# EAGLE schematic LineOut (EAGLE 7.7.0)
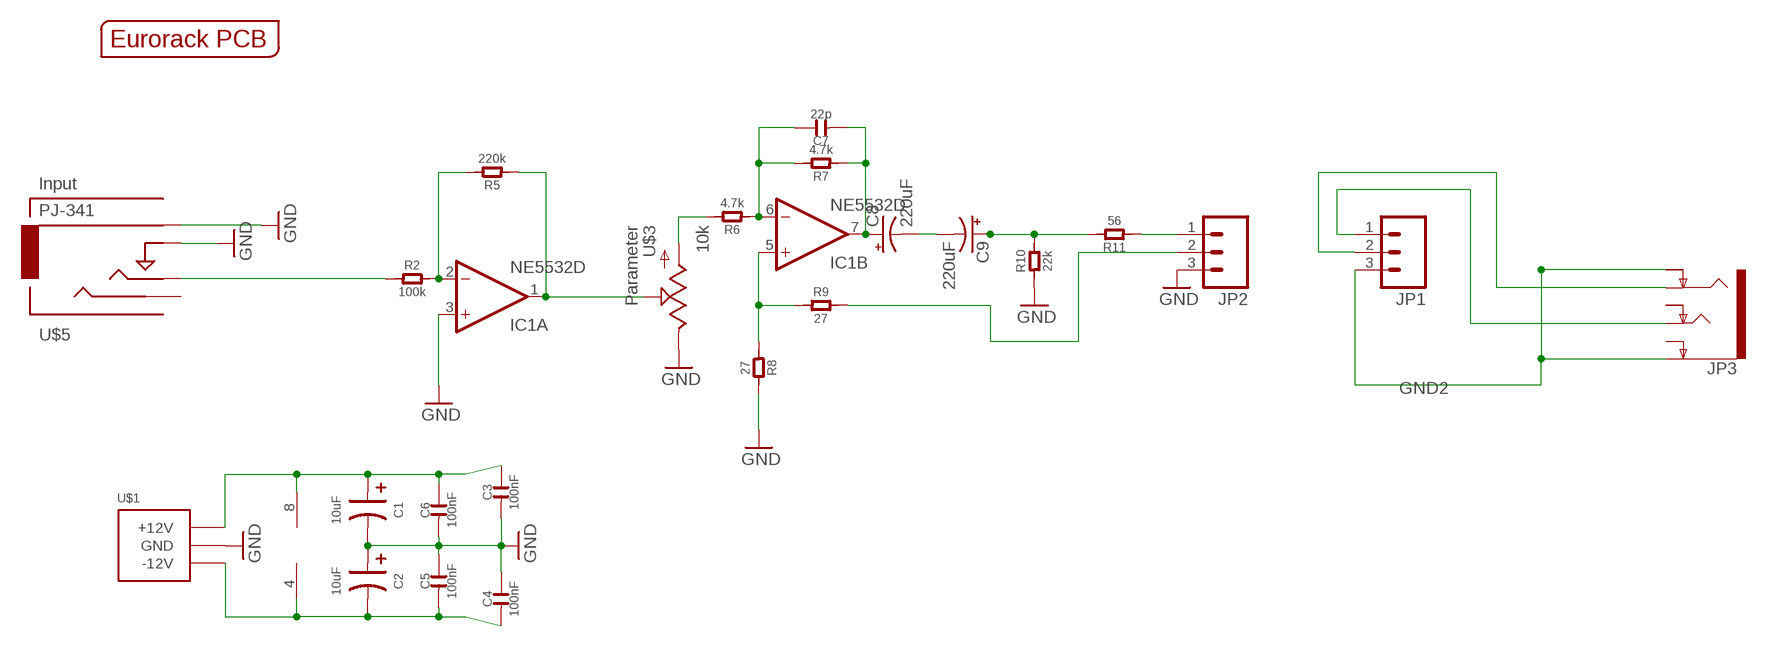
[diagram p0: schematic, sheet 1]

## Parts
C1  10uF  C-POLAR-A  [AVX-A]
C2  10uF  C-POLAR-A  [AVX-A]
C3  100nF  C-0603  [C0603]
C4  100nF  C-0603  [C0603]
C5  100nF  C-0603  [C0603]
C6  100nF  C-0603  [C0603]
C7  22p  C-0603  [C0603]
C8  220uF  CPOL-US153CLV-0505  [153CLV-0505]
C9  220uF  CPOL-US153CLV-0505  [153CLV-0505]
IC1  NE5532D  [SO08]
JP1  M03PTH  [1X03]
JP2  M03PTH  [1X03]
JP3  AUDIO-JACK4-.25-HORIZ-TRS  [AUDIO-JACK-.25-INCH-HORIZ-PTH]
R2  100k  R-0603  [R0603]
R5  220k  R-0603  [R0603]
R6  4.7k  R-0603  [R0603]
R7  4.7k  R-0603  [R0603]
R8  27  R-0603  [R0603]
R9  27  R-0603  [R0603]
R10  22k  R-0603  [R0603]
R11  56  R-0603  [R0603]
U$1  POWER_SIMPLE10  [POWER_10]
U$3  10k  POTZEPHPOT  [OG-POTS_ALPS_POT_VERTICAL]
U$5  PJ-341  AUDIO-JACKINPUT  [3.5MM-JACK-SWITCH-13MM-INPUT]
U$6  EURORACK_PCB4HP  [EURORACK4HPPCB]

## Nets
+12V: C1.+ C3.2 C6.2 IC1.8(P:V+) U$1.9(+12V) U$1.10(+12V)
-12V: C2.- C4.1 C5.1 IC1.4(P:V-) U$1.1(-12V) U$1.2(-12V)
GND: C1.- C2.+ C3.1 C4.2 C5.2 C6.1 IC1.3(A:+IN) JP2.3 R8.2 R10.1 U$1.3(GND) U$1.4(GND) U$1.5(GND) U$1.6(GND) U$1.7(GND) U$1.8(GND) U$3.P$1(E) U$5.RING@3(RING) U$5.SWITCH@3(SWITCH)
GND2: JP1.3 JP3.P$2(EARTH) JP3.P$5(RING-NORM)
N$1: JP2.1 R11.1
N$2: JP1.1 JP3.P$6(TIP)
N$3: C9.+ R10.2 R11.2
N$4: C7.1 C8.+ IC1.7(B:OUT) R7.1
N$5: IC1.5(B:+IN) R8.1 R9.1
N$6: JP2.2 R9.2
N$7: C7.2 IC1.6(B:-IN) R6.1 R7.2
N$8: IC1.2(A:-IN) R2.2 R5.2
N$9: IC1.1(A:OUT) R5.1 U$3.P$2(S)
N$12: R6.2 U$3.P$3(A)
N$13: C8.- C9.-
N$14: R2.1 U$5.TIP@3(TIP)
N$18: JP1.2 JP3.P$4(RING)
Unconnected: JP3.P$3(EARTH-NORM) JP3.P$7(TIP-NORM) U$5.SECOND@3(SECOND)

## Library data of the parts
C1 C2 = EurorackModularParts:C-POLAR*
C3-C7 = OPL:C*
C8 C9 = adafruit:CPOL-US: POLARIZED CAPACITOR, American symbol
IC1 = EurorackModularParts:NE5532: AUDIO AMPLIFIER
JP1 JP2 = SparkFun-Connectors:M03: Header 3 Standard 3-pin 0.1" header. Use with straight break away headers (SKU : PRT-00116), right angle break away headers (PRT-00553), swiss pins (PRT-00743), machine pins (PRT-00117), and female headers (PRT-00115). Molex polarized connector foot print use with SKU : PRT-08232 with associated crimp pins and housings.
JP3 = EurorackModularParts:AUDIO-JACK4-.25-HORIZ-TRS: 1/4" TRS jack, horizontal Production SKU: COM-11144 Footprint unproven - datasheet and part seem to be slightly different; PROD_ID: COM-11144
R2 R5-R11 = OPL:R*
U$1 = EurorackModularParts:POWER_SIMPLE
U$3 = EurorackModularParts:POT; DESC: Parameter
U$5 = EurorackModularParts:AUDIO-JACK: Switching Mono 3.5mm Audio Jack from Erthenvar.; DESC: Input; MPN: PJ-341
U$6 = EurorackModularParts:EURORACK_PCB